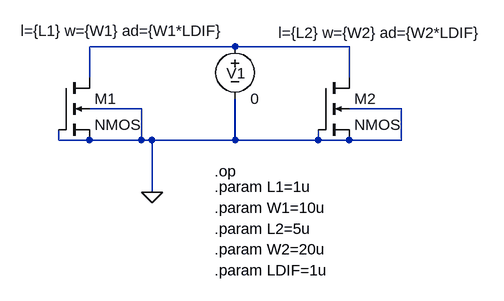
[diagram p0: schematic MosParam.asc]
MosParam.asc, the LTspice schematic file:
Version 4
SHEET 1 880 680
WIRE -64 304 -64 288
WIRE -16 208 -16 160
WIRE -16 304 -64 304
WIRE 64 256 -16 256
WIRE 64 304 -16 304
WIRE 64 304 64 256
WIRE 80 304 64 304
WIRE 80 384 80 304
WIRE 208 160 -16 160
WIRE 208 304 80 304
WIRE 208 304 208 240
WIRE 336 304 208 304
WIRE 336 304 336 288
WIRE 384 160 208 160
WIRE 384 208 384 160
WIRE 384 304 336 304
WIRE 464 256 384 256
WIRE 464 304 384 304
WIRE 464 304 464 256
FLAG 80 384 0
SYMBOL nmos4 -64 208 R0
WINDOW 123 -58 -72 Left 0
SYMATTR Value2 l={L1} w={W1} ad={W1*LDIF}
SYMATTR InstName M1
SYMBOL nmos4 336 208 R0
WINDOW 123 -61 -69 Left 0
SYMATTR Value2 l={L2} w={W2} ad={W2*LDIF}
SYMATTR InstName M2
SYMBOL voltage 208 144 R0
WINDOW 123 0 0 Left 0
WINDOW 39 0 0 Left 0
WINDOW 0 -13 57 Left 0
SYMATTR InstName V1
SYMATTR Value 0
TEXT 176 376 Left 0 !.param L1=1u
TEXT 176 408 Left 0 !.param W1=10u
TEXT 176 440 Left 0 !.param L2=5u
TEXT 176 472 Left 0 !.param W2=20u
TEXT 176 504 Left 0 !.param LDIF=1u
TEXT 176 352 Left 0 !.op

The netlist it stands for:
* MosParam.asc
M1 N001 0 0 0 NMOS l={L1} w={W1} ad={W1*LDIF}
M2 N001 0 0 0 NMOS l={L2} w={W2} ad={W2*LDIF}
V1 N001 0 0
.model NMOS NMOS
.model PMOS PMOS
.lib standard.mos
.param L1=1u
.param W1=10u
.param L2=5u
.param W2=20u
.param LDIF=1u
.op
.backanno
.end